# EAGLE design Shield (EAGLE 6.5.0)
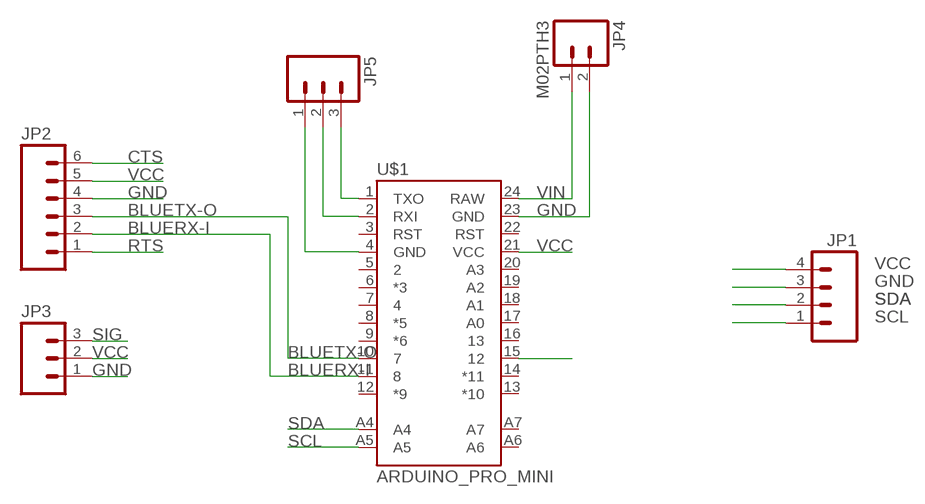
[diagram p0: schematic, sheet 1]

## Parts
JP1  M04LONGPADS  [1X04_LONGPADS]
JP2  M06LONGPADS  [1X06_LONGPADS]
JP3  M03PTH  [1X03]
JP4  M02PTH3  [1X02_LONGPADS]
JP5  M03LONGPADS  [1X03_LONGPADS]
U$1  ARDUINO_PRO_MINI  [ARDUINO_PRO_MINI]

## Nets
BLUERX-I: JP2.2 U$1.11
BLUETX-O: JP2.3 U$1.10
CTS: JP2.6
GND: JP1.3 JP2.4 JP3.1 JP4.2 JP5.1 U$1.4(GND) U$1.23(GND)
RTS: JP2.1
RX-I: JP5.2 U$1.2(RXI)
SCL: JP1.1 U$1.A5
SDA: JP1.2 U$1.A4
SIG: JP3.3 U$1.15
TX-O: JP5.3 U$1.1(TXO)
VCC: JP1.4 JP2.5 JP3.2 U$1.21(VCC)
VIN: JP4.1 U$1.24(RAW)
Unconnected: U$1.3(RST) U$1.5 U$1.6(*3) U$1.7 U$1.8(*5) U$1.9(*6) U$1.12(*9) U$1.13(*10) U$1.14(*11) U$1.16 U$1.17(A0) U$1.18(A1) U$1.19(A2) U$1.20(A3) U$1.22(RST) U$1.A6 U$1.A7

## Library data of the parts
JP1 = SparkFun-Connectors:M04: Header 4 Standard 4-pin 0.1" header. Use with straight break away headers (SKU : PRT-00116), right angle break away headers (PRT-00553), swiss pins (PRT-00743), machine pins (PRT-00117), and female headers (PRT-00115). Molex polarized connector foot print use with SKU : PRT-08231 with associated crimp pins and housings. 1MM SMD Version SKU: PRT-10208
JP2 = SparkFun-Connectors:M06: Header 6 Standard 6-pin 0.1" header. Use with straight break away headers (SKU : PRT-00116), right angle break away headers (PRT-00553), swiss pins (PRT-00743), machine pins (PRT-00117), and female headers (PRT-00115). Molex polarized connector foot print use with SKU : PRT-08094 with associated crimp pins and housings. NOTES ON THE VARIANTS LOCK and LOCK_LONGPADS... This footprint was designed to help hold the alignment of a through-hole component (i.e. 6-pin header) while soldering it into place. You may notice that each hole has been shifted either up or down by 0.005 of an inch from it's more standard position (which is a perfectly straight line). This slight alteration caused the pins (the squares in the middle) to touch the edges of the holes. Because they are alternating, it causes a "brace" to hold the component in place. 0.005 has proven to be the perfect amount of "off-center" position when using our standard breakaway headers. Although looks a little odd when you look at the bare footprint, once you have a header in there, the alteration is very hard to notice. Also,if you push a header all the way into place, it is covered up entirely on the bottom side. This idea of altering the position of holes to aid alignment will be further integrated into the Sparkfun Library for other footprints. It can help hold any component with 3 or more connection pins.
JP3 JP5 = SparkFun-Connectors:M03: Header 3 Standard 3-pin 0.1" header. Use with straight break away headers (SKU : PRT-00116), right angle break away headers (PRT-00553), swiss pins (PRT-00743), machine pins (PRT-00117), and female headers (PRT-00115). Molex polarized connector foot print use with SKU : PRT-08232 with associated crimp pins and housings.
JP4 = SparkFun-Connectors:M02: Standard 2-pin 0.1" header. Use with - straight break away headers ( PRT-00116) - right angle break away headers (PRT-00553) - swiss pins (PRT-00743) - machine pins (PRT-00117) - female headers (PRT-00115) Molex polarized connector foot print use with: PRT-08233 with associated crimp pins and housings. 2.54_SCREWTERM for use with PRT-10571. 3.5mm Screw Terminal footprints for PRT-08084 5mm Screw Terminal footprints for use with PRT-08433
U$1 = SparkFun-Boards:ARDUINO_PRO_MINI

## Board
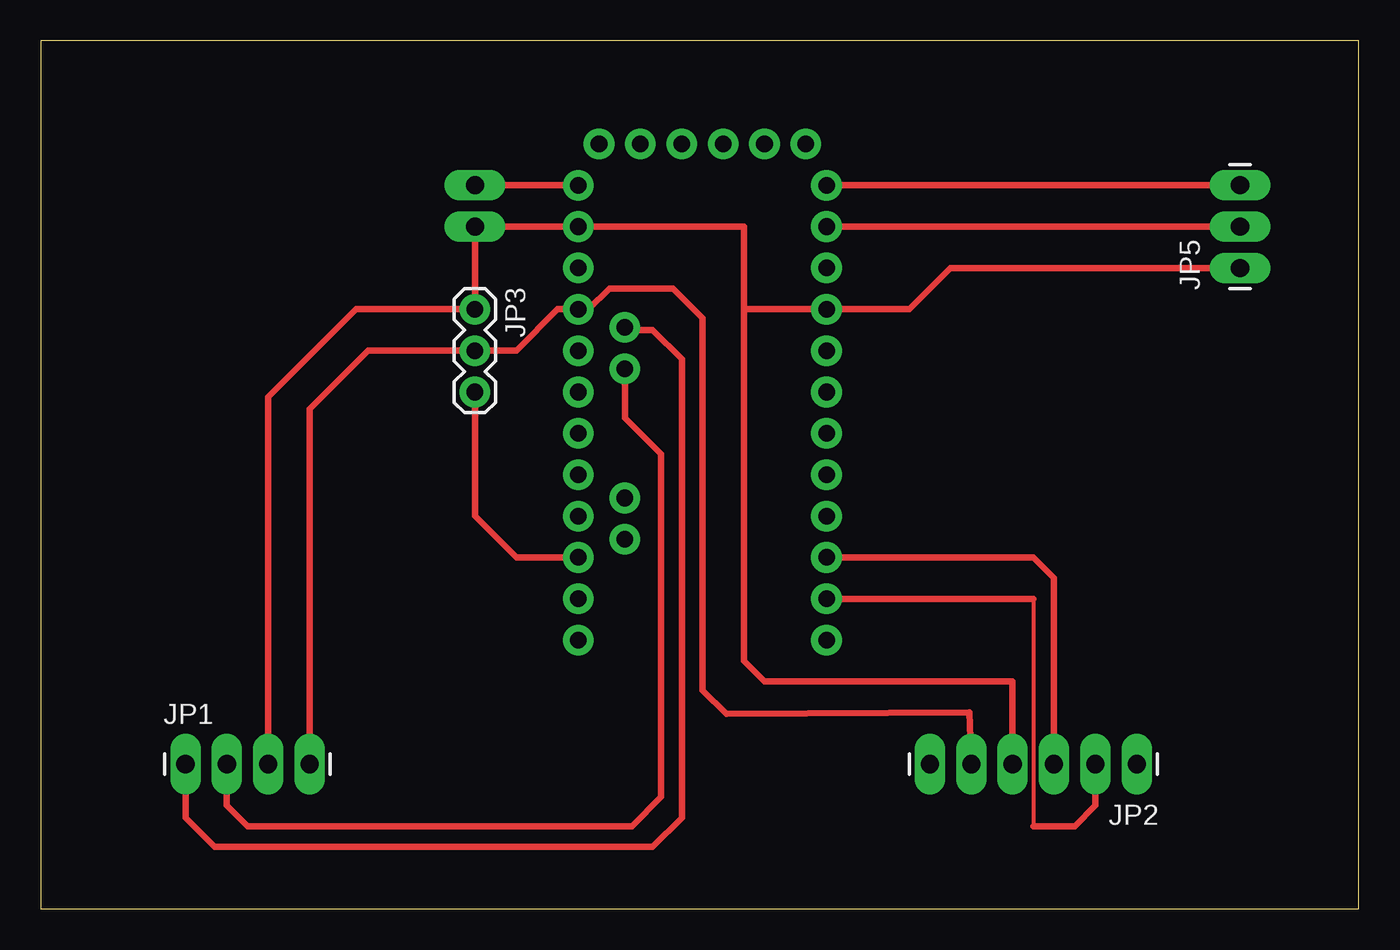
[diagram p1: board, top side]

Size 80.95 x 53.33 mm. Coordinates in mm from the lower left corner, seen from the top.
Outline: 0,0 80.95,0 80.95,53.33 0,53.33 0,0
Copper layers (1*16): Top 0.035mm / dielectric 1.5mm / Bottom 0.035mm
Design rules "default": minimum track width 10mil, minimum drill 24mil, track to track 8mil, track to pad 8mil, pad to pad 8mil, via to via 8mil, smd to smd 8mil, copper to edge 40mil, drill to drill 8mil, minimum pad ring 10mil, minimum via ring 8mil, stop-mask expansion 4mil, vias tented up to drill 0mil, thermal gap 10mil

### Footprints (pad centres in the part's own frame; a part is rotated, then mirrored left to right if it is on the bottom)
1X04_LONGPADS = drill 1.118 pad 1.88 long: 1 0,0; 2 2.54,0; 3 5.08,0; 4 7.62,0
1X06_LONGPADS = drill 1.118 pad 1.88 long: 1 0,0; 2 2.54,0; 3 5.08,0; 4 7.62,0; 5 10.16,0; 6 12.7,0
1X03 = drill 1.016 pad 1.88: 1 0,0; 2 2.54,0; 3 5.08,0
1X02_LONGPADS = drill 1.118 pad 1.88 long: 1 0,0; 2 2.54,0
1X03_LONGPADS = drill 1.118 pad 1.88 long: 1 0,0; 2 2.54,0; 3 5.08,0
ARDUINO_PRO_MINI = drill 1.016 pad 1.88: 1 -7.62,12.7; 2 -7.62,10.16; 3 -7.62,7.62; 4 -7.62,5.08; 5 -7.62,2.54; 6 -7.62,0; 7 -7.62,-2.54; 8 -7.62,-5.08; 9 -7.62,-7.62; 10 -7.62,-10.16; 11 -7.62,-12.7; 12 -7.62,-15.24; 13 7.62,-15.24; 14 7.62,-12.7; 15 7.62,-10.16; 16 7.62,-7.62; 17 7.62,-5.08; 18 7.62,-2.54; 19 7.62,0; 20 7.62,2.54; 21 7.62,5.08; 22 7.62,7.62; 23 7.62,10.16; 24 7.62,12.7; A4 4.763,1.429; A5 4.763,3.969; A6 4.763,-9.049; A7 4.763,-6.509; BLK -6.35,15.24; GND -3.81,15.24; GRN 6.35,15.24; RXI 1.27,15.24; TXO 3.81,15.24; VCC -1.27,15.24

### Placement (x,y rotation side)
JP1  8.89,8.89 0 top
JP2  67.31,8.89 180 top
JP3  26.67,36.83 270 top
JP4  26.67,44.45 270 top
JP5  73.66,39.37 90 top
U$1  40.64,31.75 0 bottom

### Tracks (layer width: path | path; a pad name or v marks a point on that pad's centre or on a via)
BLUERX-I
  Top 0.254: 60.96,19.05 60.96,5.08
  Top 0.406: U$1.11 60.96,19.05 | 60.96,5.08 63.5,5.08 64.77,6.35 JP2.2 64.77,10.16
BLUETX-O
  Top 0.406: U$1.10 60.96,21.59 62.23,20.32 JP2.3
GND
  Top 0.406: JP1.3 13.97,31.44 19.36,36.83 JP3.1 JP4.2 U$1.23 | 34.29,41.91 U$1.23 | U$1.23 43.18,41.91 43.18,36.83 | 43.18,36.83 43.18,15.24 44.45,13.97 59.69,13.97 JP2.4 | 43.18,36.83 U$1.4 53.34,36.83 55.88,39.37 JP5.1
RX-I
  Top 0.406: U$1.2 JP5.2
SCL
  Top 0.406: JP1.1 8.89,5.61 10.69,3.81 37.57,3.81 39.37,5.61 39.37,33.76 37.57,35.56 35.88,35.56 U$1.A5
SDA
  Top 0.406: JP1.2 11.43,6.35 12.7,5.08 36.3,5.08 38.1,6.88 38.1,27.94 35.88,30.16 U$1.A4
SIG
  Top 0.406: JP3.3 26.67,24.13 29.21,21.59 U$1.15
TX-O
  Top 0.406: U$1.1 JP5.3
VCC
  Top 0.406: JP1.4 16.51,30.7 20.1,34.29 JP3.2 29.21,34.29 31.75,36.83 U$1.21 33.66,36.83 34.92,38.1 38.84,38.1 40.64,36.3 40.64,13.44 42.12,11.97 57.04,12.06 JP2.5
VIN
  Top 0.406: JP4.1 U$1.24